# Altium project APC1_OBC.PrjPcb
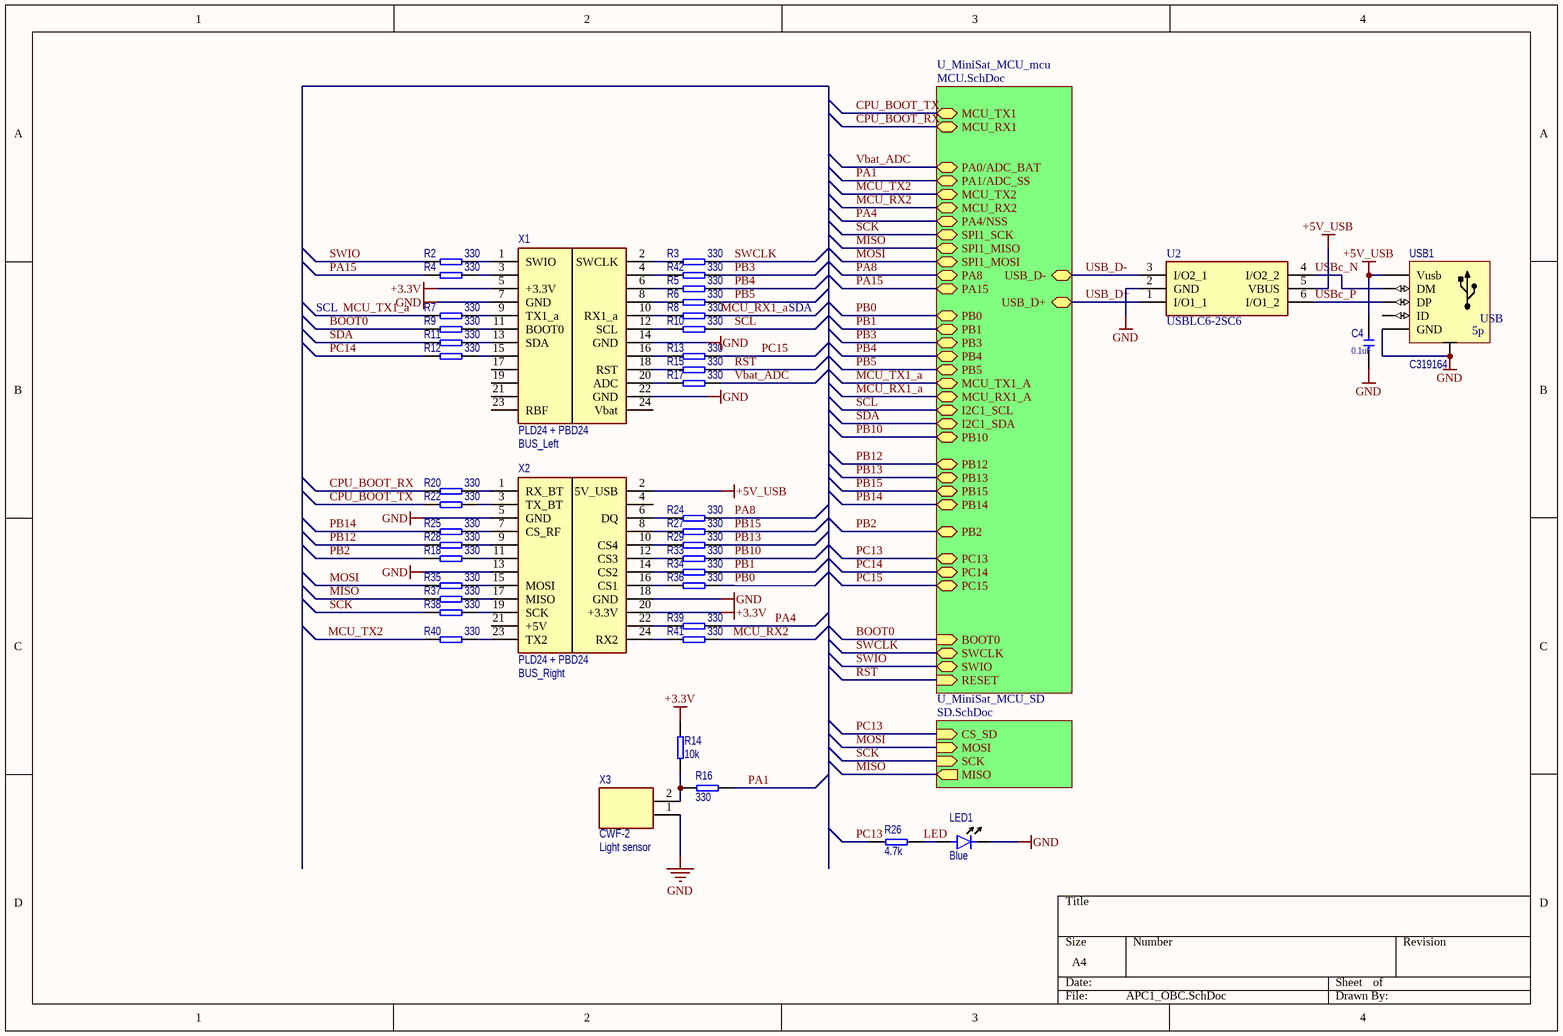
[diagram p0: APC1_OBC.SchDoc]
3 sheets, 54 parts. Net scope: hierarchical (ports join the sheet entries above them; power ports are global).
Board file: APC1_OBC.PcbDoc
Sheets:
  APC1_OBC.SchDoc
    U_MiniSat_MCU_mcu = MCU.SchDoc
    U_MiniSat_MCU_SD = SD.SchDoc

## Sheet APC1_OBC.SchDoc
size A4

### Parts
C4  value 0.1uF  [CERCAP 0402]
LED1  value Blue  [LED 0603]
R2  value 330  [RES 0402]
R3  value 330  [RES 0402]
R4  value 330  [RES 0402]
R5  value 330  [RES 0402]
R6  value 330  [RES 0402]
R7  value 330  [RES 0402]
R8  value 330  [RES 0402]
R9  value 330  [RES 0402]
R10  value 330  [RES 0402]
R11  value 330  [RES 0402]
R12  value 330  [RES 0402]
R13  value 330  [RES 0402]
R14  value 10k  [RES 0402]
R15  value 330  [RES 0402]
R16  value 330  [RES 0603]
R17  value 330  [RES 0402]
R18  value 330  [RES 0402]
R20  value 330  [RES 0402]
R22  value 330  [RES 0402]
R24  value 330  [RES 0402]
R25  value 330  [RES 0402]
R26  value 4.7k  [RES 0402]
R27  value 330  [RES 0402]
R28  value 330  [RES 0402]
R29  value 330  [RES 0402]
R33  value 330  [RES 0402]
R34  value 330  [RES 0402]
R35  value 330  [RES 0402]
R36  value 330  [RES 0402]
R37  value 330  [RES 0402]
R38  value 330  [RES 0402]
R39  value 330  [RES 0402]
R40  value 330  [RES 0402]
R41  value 330  [RES 0402]
R42  value 330  [RES 0402]
U2  USBLC6-2SC6  [SOT-666]
USB1  C319164  [USB-Micro_TH]
X1  PLD24 + PBD24  Purpose: BUS_Left  [PICOSAT_CNN]
X2  PLD24 + PBD24  Purpose: BUS_Right  [PICOSAT_CNN]
X3  CWF-2  Purpose: Light sensor  [PBS-2-2.54]

### Sub-sheets
U_MiniSat_MCU_mcu = MCU.SchDoc: RESET (in), USB_D+ (bidir), USB_D- (bidir), PB12 (bidir), PB3 (bidir), PB5 (bidir), PA15 (bidir), PB0 (bidir), PB1 (bidir), PB4 (bidir), PB10 (bidir), PA0/ADC_BAT (bidir), PA1/ADC_SS (bidir), PA8 (bidir), SWIO (bidir), SWCLK (bidir), PC13 (bidir), PC15 (bidir), PC14 (bidir), PB13 (bidir), PB15 (bidir), PB14 (bidir), BOOT0 (in), I2C1_SDA (bidir), PA4/NSS (bidir), MCU_TX1 (bidir), MCU_RX1 (bidir), MCU_TX2 (bidir), MCU_RX2 (bidir), PB2 (bidir), SPI1_SCK (bidir), SPI1_MOSI (bidir), SPI1_MISO (bidir), I2C1_SCL (bidir), MCU_RX1_A (bidir), MCU_TX1_A (bidir)
U_MiniSat_MCU_SD = SD.SchDoc: CS_SD (in), MOSI (in), SCK (in), MISO (out)

### Nets
+3.3V: R14.2 X1.5(+3.3V) X2.20(+3.3V)
+5V_USB: C4.2 U2.5(VBUS) USB1.Vusb X2.2(5V_USB)
GND: C4.1 LED1.2(Cathode) U2.2(GND) USB1.GND USB1.TH X1.7(GND) X1.14(GND) X1.22(GND) X2.5(GND) X2.13 X2.18(GND) X3.1
BOOT0: R9.1 ; sheet U_MiniSat_MCU_mcu/BOOT0
CPU_BOOT_RX: R20.1 ; sheet U_MiniSat_MCU_mcu/MCU_RX1
CPU_BOOT_TX: R22.1 ; sheet U_MiniSat_MCU_mcu/MCU_TX1
LED: LED1.1(Anode) R26.2
MCU_RX1_a: R8.2 ; sheet U_MiniSat_MCU_mcu/MCU_RX1_A
MCU_RX2: R41.2 ; sheet U_MiniSat_MCU_mcu/MCU_RX2
MCU_TX1_a: R7.1 ; sheet U_MiniSat_MCU_mcu/MCU_TX1_A
MCU_TX2: R40.1 ; sheet U_MiniSat_MCU_mcu/MCU_TX2
MISO: R37.1 ; sheet U_MiniSat_MCU_mcu/SPI1_MISO, sheet U_MiniSat_MCU_SD/MISO
MOSI: R35.1 ; sheet U_MiniSat_MCU_mcu/SPI1_MOSI, sheet U_MiniSat_MCU_SD/MOSI
PA1: R16.1 ; sheet U_MiniSat_MCU_mcu/PA1/ADC_SS
PA4: R39.2 ; sheet U_MiniSat_MCU_mcu/PA4/NSS
PA8: R24.2 ; sheet U_MiniSat_MCU_mcu/PA8
PA15: R4.1 ; sheet U_MiniSat_MCU_mcu/PA15
PB0: R36.2 ; sheet U_MiniSat_MCU_mcu/PB0
PB1: R34.2 ; sheet U_MiniSat_MCU_mcu/PB1
PB2: R18.1 ; sheet U_MiniSat_MCU_mcu/PB2
PB3: R42.2 ; sheet U_MiniSat_MCU_mcu/PB3
PB4: R5.2 ; sheet U_MiniSat_MCU_mcu/PB4
PB5: R6.2 ; sheet U_MiniSat_MCU_mcu/PB5
PB10: R33.2 ; sheet U_MiniSat_MCU_mcu/PB10
PB12: R28.1 ; sheet U_MiniSat_MCU_mcu/PB12
PB13: R29.2 ; sheet U_MiniSat_MCU_mcu/PB13
PB14: R25.1 ; sheet U_MiniSat_MCU_mcu/PB14
PB15: R27.2 ; sheet U_MiniSat_MCU_mcu/PB15
PC13: R26.1 ; sheet U_MiniSat_MCU_mcu/PC13, sheet U_MiniSat_MCU_SD/CS_SD
PC14: R12.1 ; sheet U_MiniSat_MCU_mcu/PC14
PC15: R13.2 ; sheet U_MiniSat_MCU_mcu/PC15
RST: R15.2 ; sheet U_MiniSat_MCU_mcu/RESET
SCK: R38.1 ; sheet U_MiniSat_MCU_mcu/SPI1_SCK, sheet U_MiniSat_MCU_SD/SCK
SCL: R10.2 ; sheet U_MiniSat_MCU_mcu/I2C1_SCL
SDA: R11.1 ; sheet U_MiniSat_MCU_mcu/I2C1_SDA
SWCLK: R3.2 ; sheet U_MiniSat_MCU_mcu/SWCLK
SWIO: R2.1 ; sheet U_MiniSat_MCU_mcu/SWIO
USB_D+: U2.1(I/O1_1) ; sheet U_MiniSat_MCU_mcu/USB_D+
USB_D-: U2.3(I/O2_1) ; sheet U_MiniSat_MCU_mcu/USB_D-
USBc_N: U2.4(I/O2_2) USB1.DM
USBc_P: U2.6(I/O1_2) USB1.DP
Vbat_ADC: R17.2 ; sheet U_MiniSat_MCU_mcu/PA0/ADC_BAT
NetR2_2: R2.2 X1.1(SWIO)
NetR3_1: R3.1 X1.2(SWCLK)
NetR4_2: R4.2 X1.3
NetR5_1: R5.1 X1.6
NetR6_1: R6.1 X1.8
NetR7_2: R7.2 X1.9(TX1_a)
NetR8_1: R8.1 X1.10(RX1_a)
NetR9_2: R9.2 X1.11(BOOT0)
NetR10_1: R10.1 X1.12(SCL)
NetR11_2: R11.2 X1.13(SDA)
NetR12_2: R12.2 X1.15
NetR13_1: R13.1 X1.16
NetR14_1: R14.1 R16.2 X3.2
NetR15_1: R15.1 X1.18(RST)
NetR17_1: R17.1 X1.20(ADC)
NetR18_2: R18.2 X2.11
NetR20_2: R20.2 X2.1(RX_BT)
NetR22_2: R22.2 X2.3(TX_BT)
NetR24_1: R24.1 X2.6(DQ)
NetR25_2: R25.2 X2.7(CS_RF)
NetR27_1: R27.1 X2.8
NetR28_2: R28.2 X2.9
NetR29_1: R29.1 X2.10(CS4)
NetR33_1: R33.1 X2.12(CS3)
NetR34_1: R34.1 X2.14(CS2)
NetR35_2: R35.2 X2.15(MOSI)
NetR36_1: R36.1 X2.16(CS1)
NetR37_2: R37.2 X2.17(MISO)
NetR38_2: R38.2 X2.19(SCK)
NetR39_1: R39.1 X2.22
NetR40_2: R40.2 X2.23(TX2)
NetR41_1: R41.1 X2.24(RX2)
NetR42_1: R42.1 X1.4

Not connected (* = marked no-connect by the designer): USB1 ID; X1 17 19 21 23(RBF) 24(Vbat); X2 4 21(+5V)

### Notes on the sheet
- SCL
- SDA
- (in symbol USB(5p)) USB; 5p

### Library data of the parts
C4 = !Capacitor: Capacitor; IsSMT: NoSMT; Diel: X7R; Voltage: *
LED1 = LED: Light Emittering Diode; IsSMT: NoSMT
R2-R18 R20 R22 R24-R29 R33-R42 = !Resistor: Resistor; IsSMT: NoSMT
U2 = USBLC6-2SC6: Integrated Circuit; HelpURL: https://datasheet.lcsc.com/szlcsc/STMicroelectronics-USBLC6-2SC6_C7519.pdf; Order: USBLC6-2SC6; LCSC Part #: C7519; JLCPCB Placement: Extended
USB1 = USB(5p): USB 5-pin; IsSMT: NoSMT
X1 X2 = Header 2x12: 10x2 header; IsSMT: NoSMT
X3 = Header 1x2: 2x1 header; isSMT: NoSMT

## Sheet MCU.SchDoc
size A4
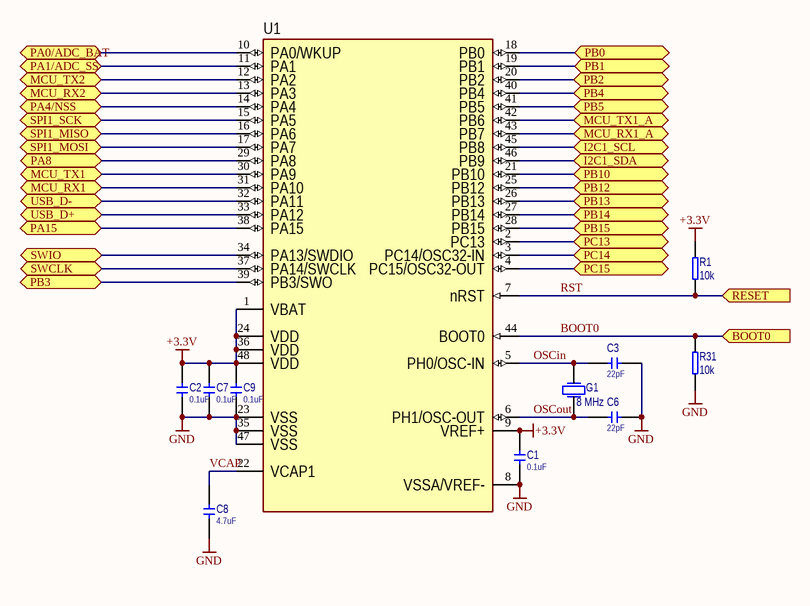
[diagram p1: MCU.SchDoc]

### Parts
C1  value 0.1uF  [CERCAP 0402]
C2  value 0.1uF  [CERCAP 0402]
C3  value 22pF  [CERCAP 0402]
C6  value 22pF  [CERCAP 0402]
C7  value 0.1uF  [CERCAP 0402]
C8  value 4.7uF  [CERCAP 0603]
C9  value 0.1uF  [CERCAP 0402]
G1  value 8 MHz  [3225]
R1  value 10k  [RES 0402]
R31  value 10k  [RES 0402]
U1  STM32F401CCU6  [QFN-48]  (value not drawn)

### Ports
BOOT0 (in), I2C1_SCL (bidir), I2C1_SDA (bidir), MCU_RX1 (bidir), MCU_RX1_A (bidir), MCU_RX2 (bidir), MCU_TX1 (bidir), MCU_TX1_A (bidir), MCU_TX2 (bidir), PA0/ADC_BAT (bidir), PA1/ADC_SS (bidir), PA4/NSS (bidir), PA8 (bidir), PA15 (bidir), PB0 (bidir), PB1 (bidir), PB2 (bidir), PB3 (bidir), PB4 (bidir), PB5 (bidir), PB10 (bidir), PB12 (bidir), PB13 (bidir), PB14 (bidir), PB15 (bidir), PC13 (bidir), PC14 (bidir), PC15 (bidir), RESET (in), SPI1_MISO (bidir), SPI1_MOSI (bidir), SPI1_SCK (bidir), SWCLK (bidir), SWIO (bidir), USB_D+ (bidir), USB_D- (bidir)

### Nets
+3.3V: C1.2 C2.2 C7.2 C9.2 R1.2 U1.1(VBAT) U1.9(VREF+) U1.24(VDD) U1.36(VDD) U1.48(VDD)
GND: C1.1 C2.1 C3.1 C6.1 C7.1 C8.1 C9.1 R31.2 U1.8(VSSA/VREF-) U1.23(VSS) U1.35(VSS) U1.47(VSS)
BOOT0: R31.1 U1.44(BOOT0) ; port BOOT0
CPU_BOOT_RX: U1.31(PA10) ; port MCU_RX1
CPU_BOOT_TX: U1.30(PA9) ; port MCU_TX1
MCU_RX1_a: U1.43(PB7) ; port MCU_RX1_A
MCU_RX2: U1.13(PA3) ; port MCU_RX2
MCU_TX1_a: U1.42(PB6) ; port MCU_TX1_A
MCU_TX2: U1.12(PA2) ; port MCU_TX2
MISO: U1.16(PA6) ; port SPI1_MISO
MOSI: U1.17(PA7) ; port SPI1_MOSI
OSCin: C3.2 G1.2 U1.5(PH0/OSC-IN)
OSCout: C6.2 G1.1 U1.6(PH1/OSC-OUT)
PA1: U1.11(PA1) ; port PA1/ADC_SS
PA4: U1.14(PA4) ; port PA4/NSS
PA8: U1.29(PA8) ; port PA8
PA15: U1.38(PA15) ; port PA15
PB0: U1.18(PB0) ; port PB0
PB1: U1.19(PB1) ; port PB1
PB2: U1.20(PB2) ; port PB2
PB3: U1.39(PB3/SWO) ; port PB3
PB4: U1.40(PB4) ; port PB4
PB5: U1.41(PB5) ; port PB5
PB10: U1.21(PB10) ; port PB10
PB12: U1.25(PB12) ; port PB12
PB13: U1.26(PB13) ; port PB13
PB14: U1.27(PB14) ; port PB14
PB15: U1.28(PB15) ; port PB15
PC13: U1.2(PC13) ; port PC13
PC14: U1.3(PC14/OSC32-IN) ; port PC14
PC15: U1.4(PC15/OSC32-OUT) ; port PC15
RST: R1.1 U1.7(nRST) ; port RESET
SCK: U1.15(PA5) ; port SPI1_SCK
SCL: U1.45(PB8) ; port I2C1_SCL
SDA: U1.46(PB9) ; port I2C1_SDA
SWCLK: U1.37(PA14/SWCLK) ; port SWCLK
SWIO: U1.34(PA13/SWDIO) ; port SWIO
USB_D+: U1.33(PA12) ; port USB_D+
USB_D-: U1.32(PA11) ; port USB_D-
Vbat_ADC: U1.10(PA0/WKUP) ; port PA0/ADC_BAT
VCAP: C8.2 U1.22(VCAP1)

### Library data of the parts
C1-C3 C6-C9 = !Capacitor: Capacitor; IsSMT: NoSMT; Diel: X7R; Voltage: *
G1 = Crystal: pin to pad: 2>3; IsSMT: NoSMT
R1 R31 = !Resistor: Resistor; IsSMT: NoSMT
U1 = STM32F401CCU6: Cortex-M4

## Sheet SD.SchDoc
size A4
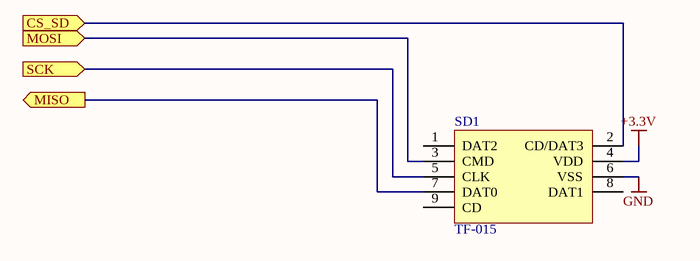
[diagram p2: SD.SchDoc]

### Parts
SD1  TF-015  [TF-015]

### Ports
CS_SD (in), MISO (out), MOSI (in), SCK (in)

### Nets
+3.3V: SD1.4(VDD)
GND: SD1.6(VSS)
MISO: SD1.7(DAT0) ; port MISO
MOSI: SD1.3(CMD) ; port MOSI
PC13: SD1.2(CD/DAT3) ; port CS_SD
SCK: SD1.5(CLK) ; port SCK

Not connected (* = marked no-connect by the designer): SD1 1(DAT2) 8(DAT1) 9(CD)

### Library data of the parts
SD1 = TF-015: Connector; Manufacturer_Name: SOFNG; Order: SD-CARD holder as in cansat; Datasheet Link: https://datasheet.lcsc.com/szlcsc/SOFNG-TF-015_C113206.pdf; Height: 1.7mm; Manufacturer_Part_Number: TF-015

## Nets that join several sheets
+3.3V: APC1_OBC (R14.2 X1.5 X2.20), MCU (10 pins), SD (SD1.4)
GND: APC1_OBC (12 pins), MCU (12 pins), SD (SD1.6)
BOOT0: APC1_OBC (R9.1), MCU (R31.1 U1.44)
CPU_BOOT_RX: APC1_OBC (R20.1), MCU (U1.31)
CPU_BOOT_TX: APC1_OBC (R22.1), MCU (U1.30)
MCU_RX1_a: APC1_OBC (R8.2), MCU (U1.43)
MCU_RX2: APC1_OBC (R41.2), MCU (U1.13)
MCU_TX1_a: APC1_OBC (R7.1), MCU (U1.42)
MCU_TX2: APC1_OBC (R40.1), MCU (U1.12)
MISO: APC1_OBC (R37.1), MCU (U1.16), SD (SD1.7)
MOSI: APC1_OBC (R35.1), MCU (U1.17), SD (SD1.3)
PA1: APC1_OBC (R16.1), MCU (U1.11)
PA4: APC1_OBC (R39.2), MCU (U1.14)
PA8: APC1_OBC (R24.2), MCU (U1.29)
PA15: APC1_OBC (R4.1), MCU (U1.38)
PB0: APC1_OBC (R36.2), MCU (U1.18)
PB1: APC1_OBC (R34.2), MCU (U1.19)
PB2: APC1_OBC (R18.1), MCU (U1.20)
PB3: APC1_OBC (R42.2), MCU (U1.39)
PB4: APC1_OBC (R5.2), MCU (U1.40)
PB5: APC1_OBC (R6.2), MCU (U1.41)
PB10: APC1_OBC (R33.2), MCU (U1.21)
PB12: APC1_OBC (R28.1), MCU (U1.25)
PB13: APC1_OBC (R29.2), MCU (U1.26)
PB14: APC1_OBC (R25.1), MCU (U1.27)
PB15: APC1_OBC (R27.2), MCU (U1.28)
PC13: APC1_OBC (R26.1), MCU (U1.2), SD (SD1.2)
PC14: APC1_OBC (R12.1), MCU (U1.3)
PC15: APC1_OBC (R13.2), MCU (U1.4)
RST: APC1_OBC (R15.2), MCU (R1.1 U1.7)
SCK: APC1_OBC (R38.1), MCU (U1.15), SD (SD1.5)
SCL: APC1_OBC (R10.2), MCU (U1.45)
SDA: APC1_OBC (R11.1), MCU (U1.46)
SWCLK: APC1_OBC (R3.2), MCU (U1.37)
SWIO: APC1_OBC (R2.1), MCU (U1.34)
USB_D+: APC1_OBC (U2.1), MCU (U1.33)
USB_D-: APC1_OBC (U2.3), MCU (U1.32)
Vbat_ADC: APC1_OBC (R17.2), MCU (U1.10)